# Altium schematic sheet 02.Interfaces.SchDoc
size A
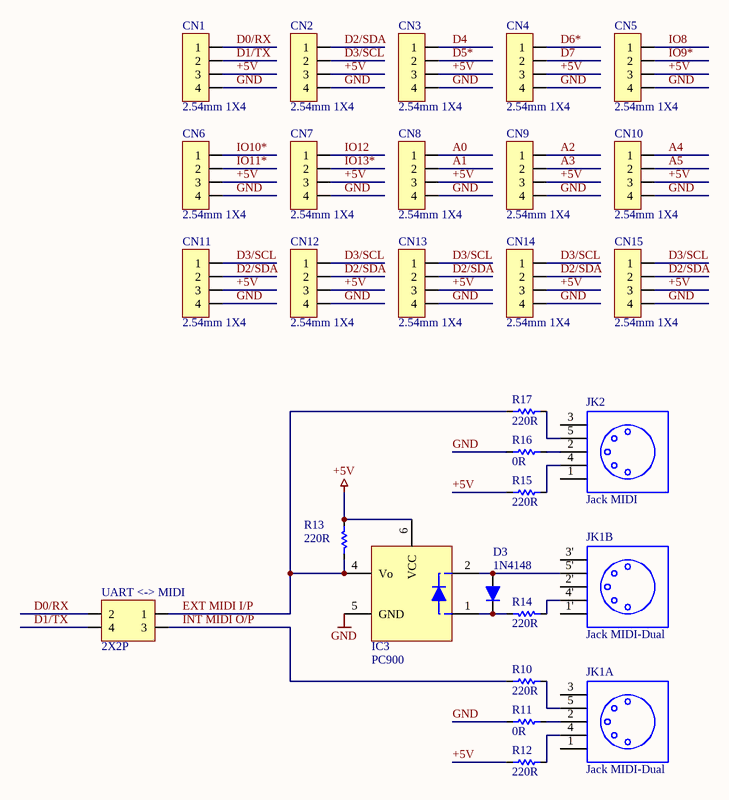
[diagram p0: 02.Interfaces.SchDoc]

## Parts
CN1  2.54mm 1X4  [Grove-4P-180D]
CN2  2.54mm 1X4  [Grove-4P-180D]
CN3  2.54mm 1X4  [Grove-4P-180D]
CN4  2.54mm 1X4  [Grove-4P-180D]
CN5  2.54mm 1X4  [Grove-4P-180D]
CN6  2.54mm 1X4  [Grove-4P-180D]
CN7  2.54mm 1X4  [Grove-4P-180D]
CN8  2.54mm 1X4  [Grove-4P-180D]
CN9  2.54mm 1X4  [Grove-4P-180D]
CN10  2.54mm 1X4  [Grove-4P-180D]
CN11  2.54mm 1X4  [Grove-4P-180D]
CN12  2.54mm 1X4  [Grove-4P-180D]
CN13  2.54mm 1X4  [Grove-4P-180D]
CN14  2.54mm 1X4  [Grove-4P-180D]
CN15  2.54mm 1X4  [Grove-4P-180D]
D3  1N4148  [SOD-323]
IC3  PC900  [DIP-6]
JK1  Jack MIDI-Dual  [HDC-052]  (parts A,B of 2)
JK2  Jack MIDI  [HDC-052-01]
R10  220R  [R0603-ROUND]
R11  0R  [R0603-ROUND]
R12  220R  [R0603-ROUND]
R13  220R  [R0603-ROUND]
R14  220R  [R0603-ROUND]
R15  220R  [R0603-ROUND]
R16  0R  [R0603-ROUND]
R17  220R  [R0603-ROUND]
UART_<->_MIDI  2X2P  [A2541WV0-2X2P]

## Nets
+5V: CN1.3 CN2.3 CN3.3 CN4.3 CN5.3 CN6.3 CN7.3 CN8.3 CN9.3 CN10.3 CN11.3 CN12.3 CN13.3 CN14.3 CN15.3 IC3.6(VCC) R12.1 R13.2 R15.1
GND: CN1.4 CN2.4 CN3.4 CN4.4 CN5.4 CN6.4 CN7.4 CN8.4 CN9.4 CN10.4 CN11.4 CN12.4 CN13.4 CN14.4 CN15.4 IC3.5(GND) R11.1 R16.1
A0: CN8.1
A1: CN8.2
A2: CN9.1
A3: CN9.2
A4: CN10.1
A5: CN10.2
D0/RX: CN1.1 UART_<->_MIDI.2
D1/TX: CN1.2 UART_<->_MIDI.4
D2/SDA: CN2.1 CN11.2 CN12.2 CN13.2 CN14.2 CN15.2
D3/SCL: CN2.2 CN11.1 CN12.1 CN13.1 CN14.1 CN15.1
D4: CN3.1
D5*: CN3.2
D6*: CN4.1
D7: CN4.2
EXT MIDI I/P: IC3.4(Vo) R13.1 R17.1 UART_<->_MIDI.1
INT MIDI O/P: R10.1 UART_<->_MIDI.3
IO8: CN5.1
IO9*: CN5.2
IO10*: CN6.1
IO11*: CN6.2
IO12: CN7.1
IO13*: CN7.2
NetD3_1: D3.1 IC3.2 JK1.5'
NetD3_2: D3.2 IC3.1 R14.2
NetJK1_2: JK1.2 R11.2
NetJK1_4: JK1.4 R12.2
NetJK1_4': JK1.4' R14.1
NetJK1_5: JK1.5 R10.2
NetJK2_2: JK2.2 R16.2
NetJK2_4: JK2.4 R15.2
NetJK2_5: JK2.5 R17.2

Not connected (* = marked no-connect by the designer): JK1 1 1' 2'(2) 3 3'; JK2 1 3

## Library data of the parts
CN1-CN15 = Connector 1X4
D3 = Diode 1N4148
IC3 = Optoisolator PC900: Sharp PC900 Optoisolator
JK1 = Jack MIDI-Dual: Dual MIDI Connector
R10-R17 = Resistor
UART_<->_MIDI = Connector 2X2